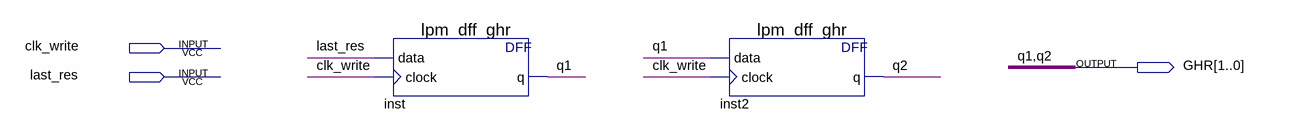
[diagram p0: schematic sheet]
// Quartus schematic GHR.bdf as structural Verilog: 2 symbols, 3 pins
module GHR (
  input  clk_write,
  input  last_res,
  output [1:0] GHR
);

  lpm_dff_ghr inst (.data(last_res), .clock(clk_write), .q(GHR[1]));
  lpm_dff_ghr inst2 (.data(GHR[1]), .clock(clk_write), .q(GHR[0]));

  // Other names for the same wires on the sheet: q1 = GHR[1]; q2 = GHR[0]
endmodule
